# Altium schematic sheet tach key1-3.SchDoc
size A3
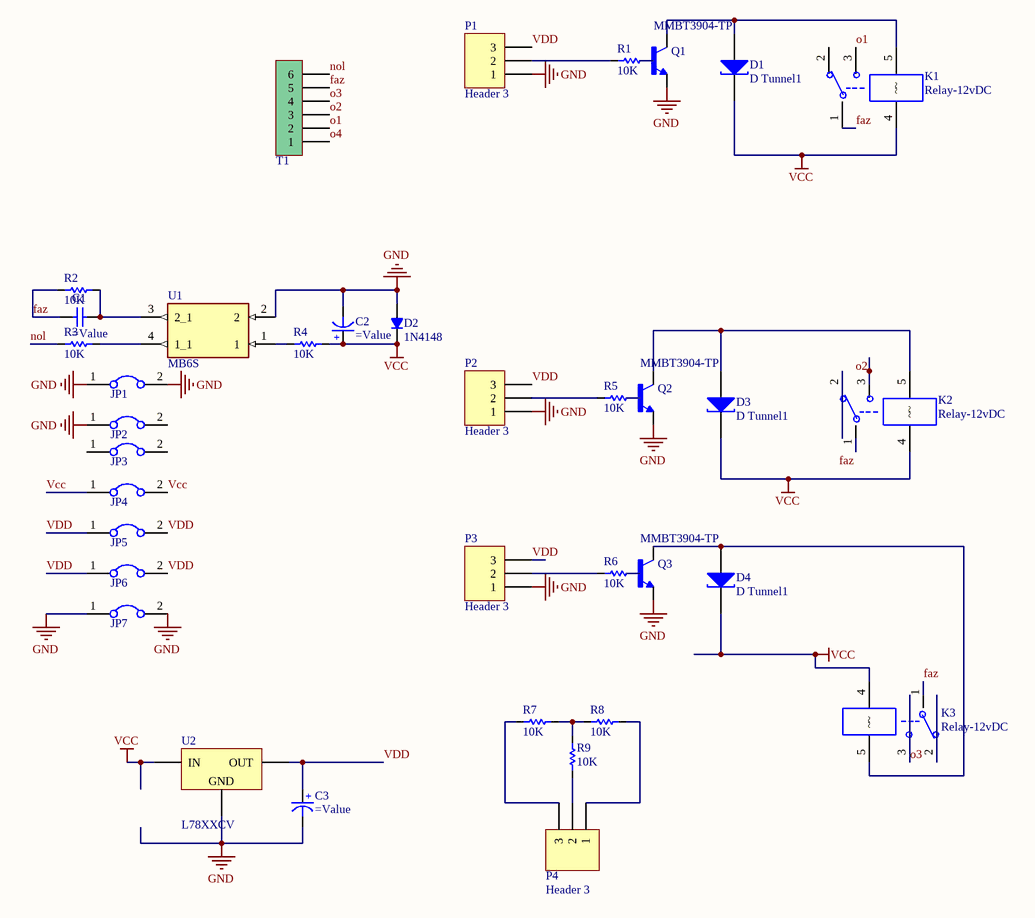
[diagram p0: tach key1-3.SchDoc]

## Parts
C1  (no value)  [CAP-30]
C2  (no value)  [ELEC-CAP-RAD10-20]
C3  (no value)  [ELEC-CAP-RAD10-20]
D1  D Tunnel1  [3.2X1.6X1.1]
D2  MODEL: 1N4148  [DO-41]  (hidden comment: MODEL)
D3  D Tunnel1  [3.2X1.6X1.1]
D4  D Tunnel1  [3.2X1.6X1.1]
JP1  Jumper  [Header 2X1]  (value not drawn)
JP2  Jumper  [Header 2X1]  (value not drawn)
JP3  Jumper  [Header 2X1]  (value not drawn)
JP4  Jumper  [Header 2X1]  (value not drawn)
JP5  Jumper  [Header 2X1]  (value not drawn)
JP6  Jumper  [Header 2X1]  (value not drawn)
JP7  Jumper  [Header 2X1]  (value not drawn)
K1  Relay-12vDC  [Relays]
K2  Relay-12vDC  [Relays]
K3  Relay-12vDC  [Relays]
P1  Header 3  [HDR1X3]
P2  Header 3  [HDR1X3]
P3  Header 3  [HDR1X3]
P4  Header 3  [HDR1X3]
Q1  MMBT3904-TP  [SOT23-3]
Q2  MMBT3904-TP  [SOT23-3]
Q3  MMBT3904-TP  [SOT23-3]
R1  10K  [RES 0805 (2012X06L)]
R2  10K  [Res-(1/4)]
R3  10K  [Res-(1/4)]
R4  10K  [Res-(2/1)-Stand]
R5  10K  [RES 0805 (2012X06L)]
R6  10K  [Res-(1/4)]
R7  10K  [RES 0805 (2012X06L)]
R8  10K  [RES 0805 (2012X06L)]
R9  10K  [RES 0805 (2012X06L)]
T1  Phoenix terminal  [phoenix terminal 6]  (value not drawn)
U1  MB6S  [SOIC245P670X270-4N]
U2  L78XXCV  [TO-220]

## Nets
GND: C2.1(-) C3.1(-) D2.1(A) JP1.1 JP1.2 JP2.1 JP7.1 JP7.2 P1.1 P2.1 P3.1 Q1.2(E) Q2.2(E) Q3.2(E) U1.2 U2.2(GND)
Vcc: C2.2(+) D1.2(K) D2.2(K) D3.2(K) D4.2(K) JP4.1 JP4.2 K1.4 K2.4 K3.4 R4.2 U2.1(IN)
faz: C1.1(+) K1.1(COM) K2.1(COM) K3.1(COM) R2.2 T1.5
nol: R3.2 T1.6
o1: K1.3(NO) T1.2
o2: K2.3(NO) T1.3
o3: K3.3(NO) T1.4
o4: T1.1
VDD: C3.2(+) JP5.1 JP5.2 JP6.1 JP6.2 P1.3 P2.3 P3.3 U2.3(OUT)
NetC1_2: C1.2(-) R2.1 U1.3(2_1)
NetD1_1: D1.1(A) K1.5 Q1.3(C)
NetD3_1: D3.1(A) K2.5 Q2.3(C)
NetD4_1: D4.1(A) K3.5 Q3.3(C)
NetP1_2: P1.2 R1.1
NetP2_2: P2.2 R5.1
NetP3_2: P3.2 R6.1
NetP4_1: P4.1 R8.2
NetP4_2: P4.2 R9.1
NetP4_3: P4.3 R7.1
NetQ1_1: Q1.1(B) R1.2
NetQ2_1: Q2.1(B) R5.2
NetQ3_1: Q3.1(B) R6.2
NetR3_1: R3.1 U1.4(1_1)
NetR4_1: R4.1 U1.1
NetR7_2: R7.2 R8.1 R9.2

Not connected (* = marked no-connect by the designer): JP2 2; JP3 1 2; K1 2(NC); K2 2(NC); K3 2(NC)

## Library data of the parts
C1 = Capacitor
C2 C3 = Capacitor Electrolytic: Electrolytic Capacitor
D1 D3 D4 = D Tunnel1: Tunnel Diode - RLC Model; Published: 8-Jun-2000; LatestRevisionDate: 17-Jul-2002; LatestRevisionNote: Re-released for DXP Platform.; PackageVersion: Feb-2002; PackageReference: 3.2X1.6X1.1; Publisher: Altium Limited; PackageDescription: SM LED; 2 Flat Leads
D2 = Diode
K1-K3 = Relay-05vDC: Relay-05vDC-240AC 5A; Designer: Seyed Mohsen Ghasemain; ComponentLinkURL: www.picpars.com
P1-P4 = Header 3: Header, 3-Pin; LatestRevisionDate: 17-Jul-2002; LatestRevisionNote: Re-released for DXP Platform.; Publisher: Altium Limited
Q1-Q3 = MMBT3904-TP: Bipolar _BJT_ Transistor NPN 40V 200mA 300MHz 350mW Surface Mount SOT-23; MF: Micro Commercial; Value: *; MP: MMBT3904-TP; Package: SOT-23 Micro Commercial; Price: None; Availability: Unavailable; SnapEDA_Link: https://www.snapeda.com/parts/MMBT3904-TP/Micro%20Commercial/view-part/805928/?ref=snap
R1-R9 = Resistor: Tolerance: 5%; Power: 1/4 W; Value: 10K
T1 = Phoenix terminal 6: Terminal 6 Pin; Designer: Seyed Mohsen Ghasemain; E-mail: picpars@gmail.com; ComponentLinkURL: www.picpars.com
U1 = MB6S: Bridge Rectifier Single Phase Standard 600V Surface Mount 4-SOIC; MF: ON Semiconductor; Digi-Key_Purchase_URL: https://www.digikey.com.tr/product-detail/en/on-semiconductor/MB6S/MB6SCT-ND/965654?utm_source=snapeda&utm_medium=aggregator&utm_campaign=symbol; Value: *; Package: BESOP-4 Surge Components; Digi-Key_Part_Number: MB6SCT-ND; SnapEDA_Link: https://www.snapeda.com/parts/MB6S/ON%20Semiconductor/view-part/2774209/?ref=snap; MP: MB6S
U2 = L78XXCV: Fixed Voltage Regulator